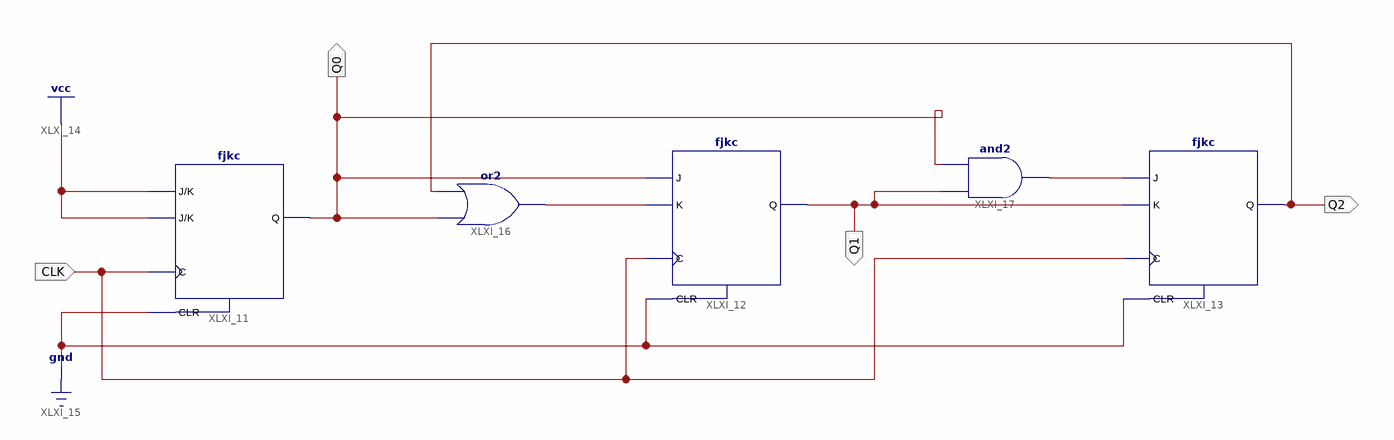
[diagram p0: schematic sheet 1]
// Xilinx ISE schematic main.sch (spartan6) as structural Verilog: 5 symbols, 4 ports
module main (
  input  CLK,
  output Q2,
  output Q0,
  output Q1
);

  wire XLXN_29, XLXN_33;

  fjkc XLXI_11 (.C(CLK), .CLR(1'b0), .J(1'b1), .K(1'b1), .Q(Q0));
  fjkc XLXI_12 (.C(CLK), .CLR(1'b0), .J(Q0), .K(XLXN_29), .Q(Q1));
  fjkc XLXI_13 (.C(CLK), .CLR(1'b0), .J(XLXN_33), .K(Q1), .Q(Q2));
  or XLXI_16 (XLXN_29, Q0, Q2);
  and XLXI_17 (XLXN_33, Q1, Q0);
endmodule
